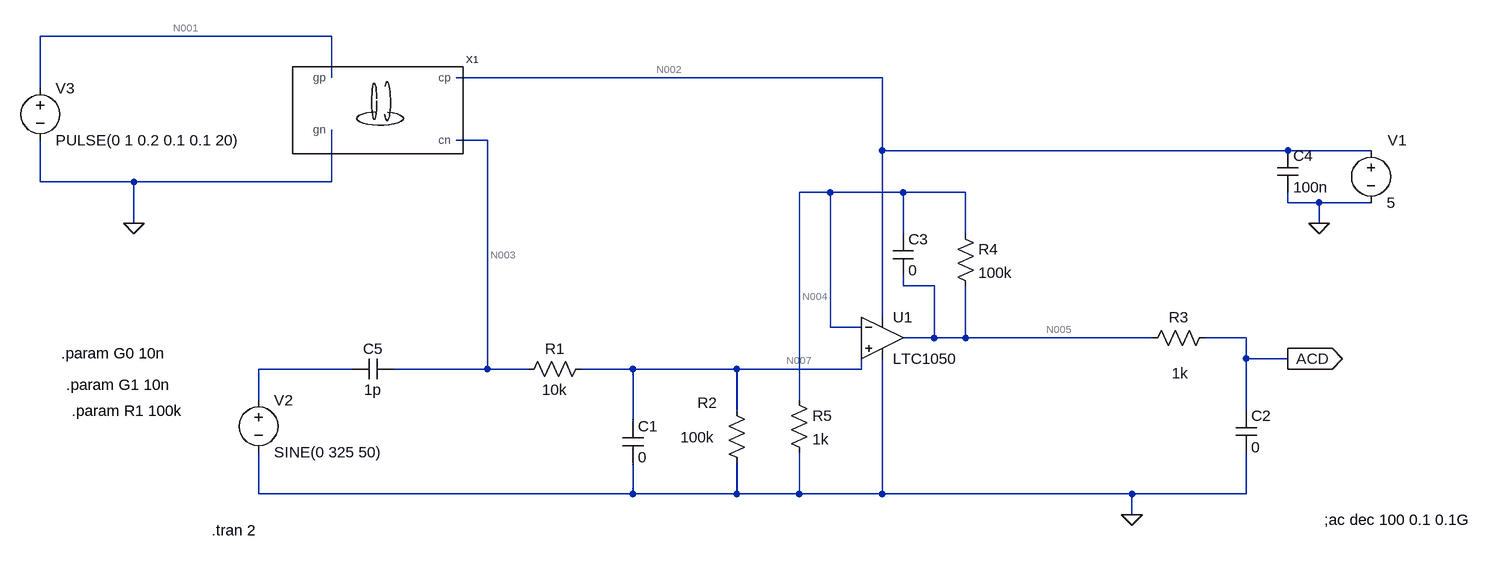
[diagram p0: schematic Draft1.asc]
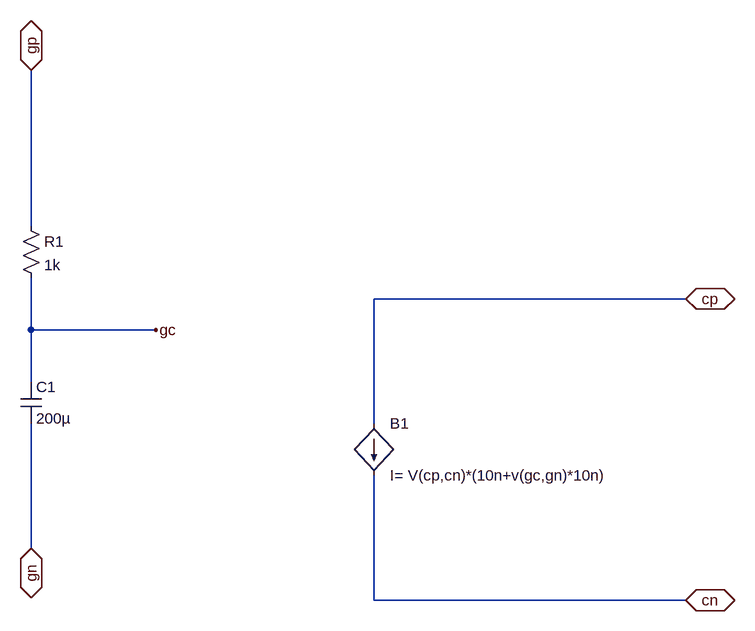
[diagram p1: sub-circuit capteur.asc]
Draft1.asc, the LTspice schematic file:
Version 4
SHEET 1 1528 680
WIRE -240 -192 -688 -192
WIRE -240 -128 -240 -192
WIRE 608 -128 -48 -128
WIRE -688 -112 -688 -192
WIRE 0 -32 -48 -32
WIRE 608 -16 608 -128
WIRE 1232 -16 608 -16
WIRE 1360 -16 1232 -16
WIRE -688 32 -688 -32
WIRE -544 32 -688 32
WIRE -240 32 -240 -48
WIRE -240 32 -544 32
WIRE 528 48 480 48
WIRE 640 48 528 48
WIRE 736 48 640 48
WIRE 1232 64 1232 48
WIRE 1280 64 1232 64
WIRE 1360 64 1280 64
WIRE -544 96 -544 32
WIRE 1280 96 1280 64
WIRE 640 112 640 48
WIRE 736 112 736 48
WIRE 640 192 640 176
WIRE 688 192 640 192
WIRE 608 240 608 -16
WIRE 528 256 528 48
WIRE 576 256 528 256
WIRE 688 272 688 192
WIRE 688 272 640 272
WIRE 736 272 736 192
WIRE 736 272 688 272
WIRE 1024 272 736 272
WIRE 1168 272 1104 272
WIRE 1168 304 1168 272
WIRE 1232 304 1168 304
WIRE -208 320 -352 320
WIRE 0 320 0 -32
WIRE 0 320 -144 320
WIRE 64 320 0 320
WIRE 224 320 144 320
WIRE 384 320 224 320
WIRE 576 320 576 288
WIRE 576 320 384 320
WIRE -352 368 -352 320
WIRE 480 368 480 48
WIRE 384 384 384 320
WIRE 1168 384 1168 304
WIRE 224 400 224 320
WIRE -352 512 -352 448
WIRE 224 512 224 464
WIRE 224 512 -352 512
WIRE 384 512 384 464
WIRE 384 512 224 512
WIRE 480 512 480 448
WIRE 480 512 384 512
WIRE 608 512 608 304
WIRE 608 512 480 512
WIRE 992 512 608 512
WIRE 1168 512 1168 448
WIRE 1168 512 992 512
WIRE 992 544 992 512
FLAG 992 544 0
FLAG 1280 96 0
FLAG 1232 304 ACD
IOPIN 1232 304 Out
FLAG -544 96 0
SYMBOL res 160 304 R90
WINDOW 0 0 56 VBottom 2
WINDOW 3 32 56 VTop 2
SYMATTR InstName R1
SYMATTR Value 10k
SYMBOL res 400 480 R180
WINDOW 0 46 108 Left 2
WINDOW 3 50 55 Left 2
SYMATTR InstName R2
SYMATTR Value 100k
SYMBOL res 1008 288 R270
WINDOW 0 32 56 VTop 2
WINDOW 3 -23 58 VBottom 2
SYMATTR InstName R3
SYMATTR Value 1k
SYMBOL res 720 96 R0
SYMATTR InstName R4
SYMATTR Value 100k
SYMBOL cap 208 400 R0
SYMATTR InstName C1
SYMATTR Value 0
SYMBOL cap 1152 384 R0
SYMATTR InstName C2
SYMATTR Value 0
SYMBOL cap 624 112 R0
SYMATTR InstName C3
SYMATTR Value 0
SYMBOL OpAmps\\LTC1050 608 208 R0
SYMATTR InstName U1
SYMBOL res 464 352 R0
SYMATTR InstName R5
SYMATTR Value 1k
SYMBOL voltage 1360 -32 R0
WINDOW 0 26 0 Left 2
WINDOW 123 0 0 Left 0
WINDOW 39 0 0 Left 0
SYMATTR InstName V1
SYMATTR Value 5
SYMBOL cap 1216 -16 R0
SYMATTR InstName C4
SYMATTR Value 100n
SYMBOL voltage -352 352 R0
WINDOW 123 0 0 Left 0
WINDOW 39 0 0 Left 0
SYMATTR InstName V2
SYMATTR Value SINE(0 325 50)
SYMBOL cap -144 304 R90
WINDOW 0 0 32 VBottom 2
WINDOW 3 32 32 VTop 2
SYMATTR InstName C5
SYMATTR Value 1p
SYMBOL voltage -688 -128 R0
WINDOW 123 0 0 Left 0
WINDOW 39 0 0 Left 0
SYMATTR InstName V3
SYMATTR Value PULSE(0 1 0.2 0.1 0.1 20)
SYMBOL capteur -80 -48 R0
SYMATTR InstName X1
TEXT -424 568 Left 2 !.tran 2
TEXT 1288 552 Left 2 !;ac dec 100 0.1 0.1G
TEXT -656 296 Left 2 !.param G0 10n
TEXT -648 344 Left 2 !.param G1 10n
TEXT -640 384 Left 2 !.param R1 100k

capteur.asc, the sub-circuit schematic file:
Version 4
SHEET 1 880 680
WIRE -384 -192 -384 -432
WIRE 624 -80 144 -80
WIRE -384 -32 -384 -112
WIRE -192 -32 -384 -32
WIRE -384 48 -384 -32
WIRE 144 112 144 -80
WIRE -384 304 -384 112
WIRE 144 384 144 192
WIRE 624 384 144 384
FLAG 624 -80 cp
IOPIN 624 -80 BiDir
FLAG 624 384 cn
IOPIN 624 384 BiDir
FLAG -384 304 gn
IOPIN -384 304 BiDir
FLAG -384 -432 gp
IOPIN -384 -432 BiDir
FLAG -192 -32 gc
SYMBOL bi 144 112 R0
SYMATTR InstName B1
SYMATTR Value I= V(cp,cn)*(10n+v(gc,gn)*10n)
SYMBOL res -400 -208 R0
SYMATTR InstName R1
SYMATTR Value 1k
SYMBOL cap -400 48 R0
SYMATTR InstName C1
SYMATTR Value 200µ

The netlist it stands for:
* Draft1.asc
R1 N007 N003 10k
R2 0 N007 100k
R3 N005 ACD 1k
R4 N004 N005 100k
C1 N007 0 0
C2 ACD 0 0
C3 N004 N005 0
XU1 N007 N004 N002 0 N005 LTC1050  ; pins In+ In- V+ V- OUT
R5 N004 0 1k
V1 N002 0 5
C4 N002 0 100n
V2 N006 0 SINE(0 325 50)
C5 N003 N006 1p
V3 N001 0 PULSE(0 1 0.2 0.1 0.1 20)
XX1 N002 N003 N001 0 capteur

* block symbol definitions
.subckt capteur cp cn gp gn
B1 cp cn I= V(cp,cn)*(10n+v(gc,gn)*10n)
R1 gp gc 1k
C1 gc gn 200µ
.ends capteur

.tran 2
;ac dec 100 0.1 0.1G
.param G0 10n
.param G1 10n
.param R1 100k
.lib LTC.lib
.backanno
.end

* Results of the author's LTspice run, read from the files saved beside the schematic
* Operating Point, zero values left out:
*   V(n007) = 4.995 mV
*   V(n003) = 5.494 mV
*   V(n005) = 504.4 mV
*   V(acd) = 504.4 mV
*   V(n004) = 4.995 mV
*   V(n002) = 5 V
*   I(R5) = 4.995 µA
*   I(R4) = -4.995 µA
*   I(R2) = -49.95 nA
*   I(R1) = -49.95 nA
*   I(V1) = -754.2 µA
*   Ix(u1:3) = 754.1 µA
*   Ix(u1:4) = -749.1 µA
*   Ix(u1:5) = -4.995 µA
*   Ix(x1:CP) = 49.95 nA
*   Ix(x1:CN) = -49.95 nA
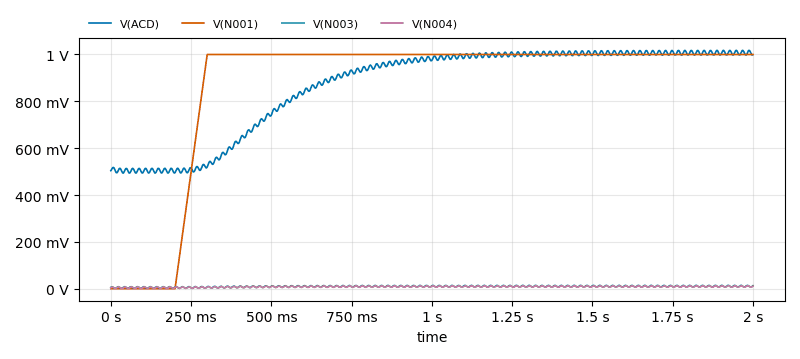
[diagram p2: Transient Analysis of Draft1.asc, plotted from the saved traces]
* Transient Analysis, 1 run:
*   V(ACD): min 493.8 mV, max 1.018 V, average 867.1 mV, rms 887.7 mV, last 999.1 mV
*   V(N001): min 0 V, max 1 V, average 875 mV, rms 930.9 mV, last 1 V
*   V(N003): min 1.783 mV, max 14.45 mV, average 9.713 mV, rms 10.21 mV, last 12.91 mV
*   V(N004): min 1.679 mV, max 13.06 mV, average 8.828 mV, rms 9.259 mV, last 10.91 mV